# EAGLE schematic InhalerCapDevelopmentBoard (EAGLE 7.2.0)
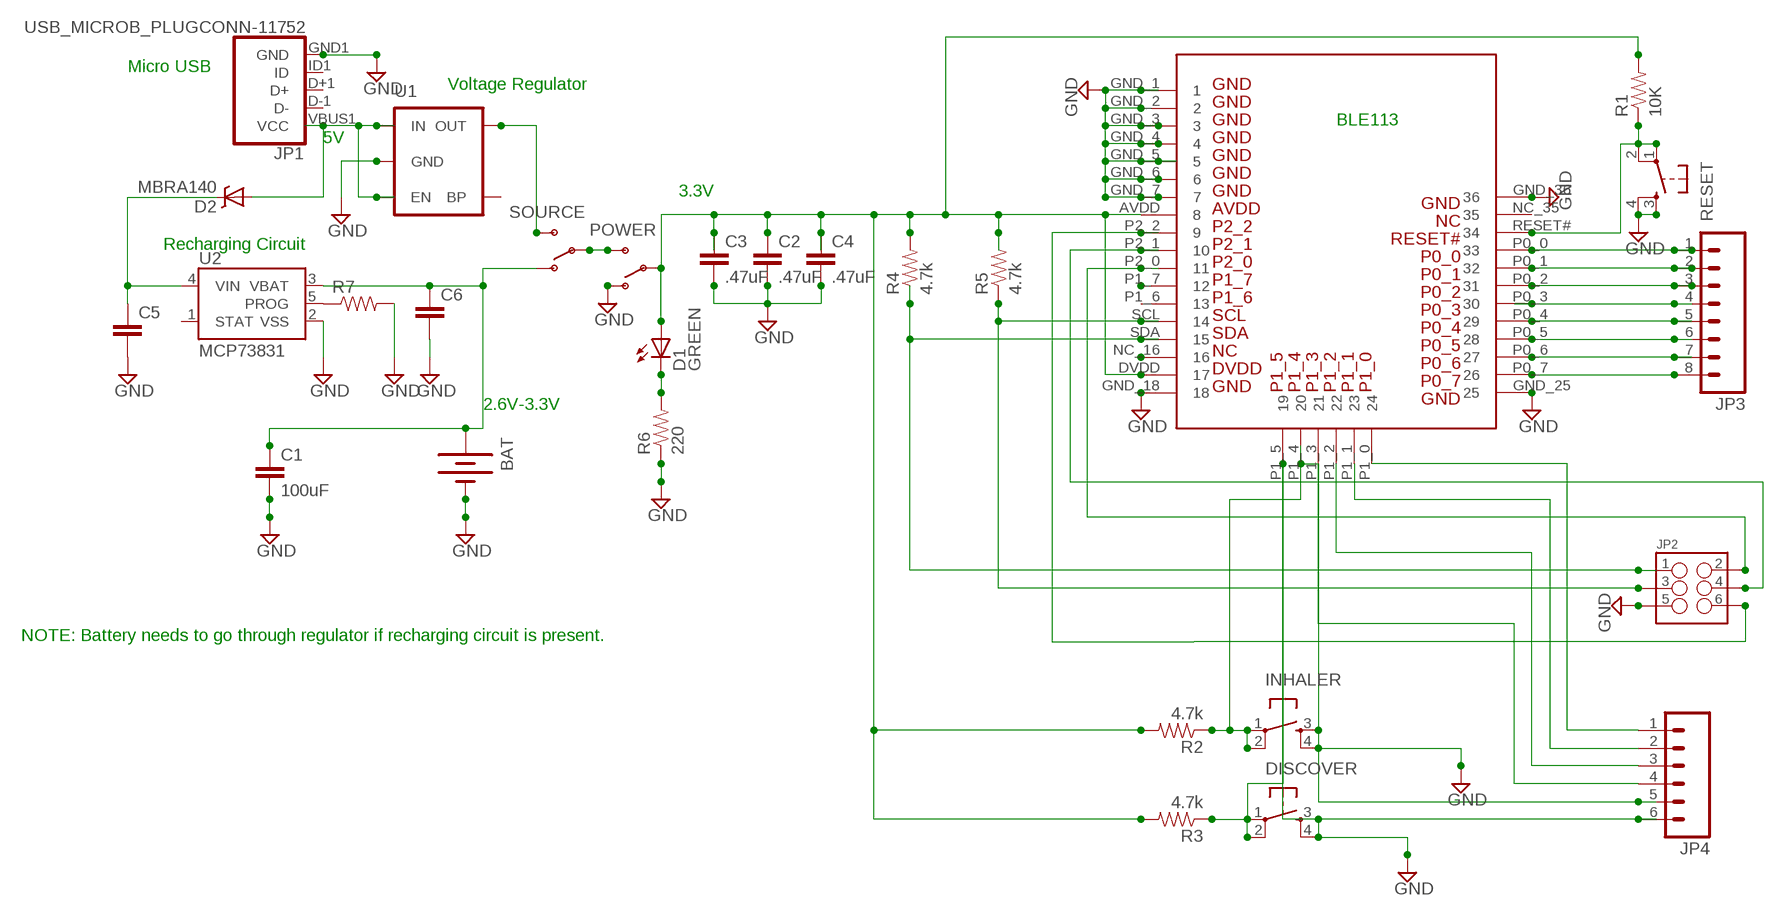
[diagram p0: schematic, sheet 1]

## Parts
BAT  BATTERY20SMD  [BATTCON_20MM]
BLE113  BLE113-A  [BLE113-A]
C1  100uF  CAP0603-CAP  [0603-CAP]
C2  .47uF  CAP0603-CAP  [0603-CAP]
C3  .47uF  CAP0603-CAP  [0603-CAP]
C4  .47uF  CAP0603-CAP  [0603-CAP]
C5  CAP0603-CAP  [0603-CAP]
C6  CAP0603-CAP  [0603-CAP]
D1  GREEN  LED-GREEN0603  [LED-0603]
D2  MBRA140  [SMA-DIODE]
DISCOVER  TAC_SWITCHSMD  [TACTILE_SWITCH_SMD]
INHALER  TAC_SWITCHSMD  [TACTILE_SWITCH_SMD]
JP1  USB_MICROB_PLUGCONN-11752  [USB-B-MICRO-SMD_V03]
JP2  M03X2SHROUD  [2X3-SHROUDED]
JP3  M08  [1X08_PIN1_NO_SILK]
JP4  M06NO_SILK  [1X06_NO_SILK]
POWER  SWITCH-SPDTSMD  [AYZ0202]
R1  10K  RESISTOR0603  [0603-RES]
R2  4.7k  RESISTOR0603  [0603-RES]
R3  4.7k  RESISTOR0603  [0603-RES]
R4  4.7k  RESISTOR0603  [0603-RES]
R5  4.7k  RESISTOR0603  [0603-RES]
R6  220  RESISTOR0603-RES  [0603-RES]
R7  RESISTOR0603-RES  [0603-RES]
RESET  TAC_SWITCHSMD  [TACTILE_SWITCH_SMD]
SOURCE  SWITCH-SPDTSMD  [AYZ0202]
U1  MIC52053.3V  [SOT23-5]
U2  MCP73831  [SOT23-5]

## Nets
GND: BAT.2(-) BLE113.GND_1 BLE113.GND_2 BLE113.GND_3 BLE113.GND_4 BLE113.GND_5 BLE113.GND_6 BLE113.GND_7 BLE113.GND_18 BLE113.GND_25 BLE113.GND_36 C1.2 C2.2 C3.2 C4.2 C5.2 C6.2 DISCOVER.3 DISCOVER.4 INHALER.3 INHALER.4 JP1.GND1(GND) JP2.5 POWER.1(O) R6.1 R7.2 RESET.3 RESET.4 U1.2(GND) U2.2(VSS)
N$1: BLE113.P1_4 INHALER.1 INHALER.2 JP4.5 R2.1
N$2: BLE113.AVDD BLE113.DVDD C2.1 C3.1 C4.1 D1.A POWER.2(P) R1.2 R2.2 R3.2 R4.2 R5.2
N$3: POWER.3(S) SOURCE.2(P)
N$5: SOURCE.3(S) U1.5(OUT)
N$6: D2.A JP1.VBUS1(VCC) U1.1(IN) U1.3(EN)
N$7: BLE113.RESET# R1.1 RESET.1 RESET.2
N$8: BLE113.P0_6 JP3.7
N$9: BLE113.P0_4 JP3.5
N$10: BLE113.P1_7
N$11: BLE113.NC_16
N$12: BLE113.P1_2 JP4.3
N$13: BLE113.P1_5 DISCOVER.1 DISCOVER.2 JP4.6 R3.1
N$14: BLE113.SDA JP2.1 R4.1
N$15: BLE113.SCL JP2.3 R5.1
N$16: D1.C R6.2
N$17: BLE113.P1_0 JP4.1
N$18: BLE113.P0_0 JP3.1
N$19: BLE113.P1_1 JP4.2
N$20: BLE113.P0_1 JP3.2
N$21: BLE113.P2_0 JP2.2
N$22: BLE113.P2_1 JP2.4
N$23: BLE113.P2_2 JP2.6
N$24: BLE113.P0_2 JP3.3
N$25: BLE113.P1_3 JP4.4
N$26: BLE113.P0_3 JP3.4
N$27: BLE113.P0_5 JP3.6
N$28: BLE113.P0_7 JP3.8
N$29: R7.1 U2.5(PROG)
N$30: C5.1 D2.C U2.4(VIN)
N$31: BAT.1(+) C1.1 C6.1 SOURCE.1(O) U2.3(VBAT)
Unconnected: BLE113.NC_35 BLE113.P1_6 JP1.D+1(D+) JP1.D-1(D-) JP1.ID1(ID) U1.4(BP) U2.1(STAT)

## Notes on the sheet
- Micro USB
- Voltage Regulator
- BLE113
- 5V
- 3.3V
- Recharging Circuit
- 2.6V-3.3V
- NOTE: Battery needs to go through regulator if recharging circuit is present.

## Library data of the parts
BAT = SparkFun-Electromechanical:BATTERY: Battery Holders Various common sizes : AA, AAA, 20mm coin cell and 12mm coin cell. 20MM_4LEGS, BATT-10373
BLE113 = BLE113-A:BLE113-A
C1 C5 = SparkFun-Passives:CAP: Capacitor Standard 0603 ceramic capacitor, and 0.1" leaded capacitor.
C2-C4 C6 = SparkFun-Capacitors:CAP: Capacitor Standard 0603 ceramic capacitor, and 0.1" leaded capacitor.
D1 = SparkFun-LED:LED-GREEN: Various green LEDs Green LEDs used in SFE Production 0603- DIO-00821 LARGE- DIO-00862 LILYPAD- DIO-09910; PROD_ID: DIO-00821
D2 = SparkFun-DiscreteSemi:MBRA140: 40V, 1A Schottky rectifier SMA/DO-214AC package DIO-08053; PROD_ID: DIO-08053
DISCOVER INHALER RESET = SparkFun-Electromechanical:TAC_SWITCH: Momentary Switch Button commonly used for reset or general input. Spark Fun Electronics SKU : COM-00097 SMT- SWCH-08247; PROD_ID: SWCH-08247
JP1 = SparkFun-Connectors:USB_MICROB_PLUG: USB Micro-B Plug Comes in a variety of packages. Check out Hirose's ZX-x0 line: http://www.hirose.co.jp/cataloge_hp/e24200011.pdf; PROD_ID: CONN-11752
JP2 = SparkFun-Connectors:M03X2: 2x3 .1" header. Shrouded, with keying- CONN-10681 SMT- CONN-11415 Pogo pins- HW-11044; PROD_ID: CONN-10681
JP3 = SparkFun-Connectors:M08: Header 8 Standard 8-pin 0.1" header. Use with straight break away headers (SKU : PRT-00116), right angle break away headers (PRT-00553), swiss pins (PRT-00743), machine pins (PRT-00117), and female headers (PRT-00115).
JP4 = SparkFun-Connectors:M06: Header 6 Standard 6-pin 0.1" header. Use with straight break away headers (SKU : PRT-00116), right angle break away headers (PRT-00553), swiss pins (PRT-00743), machine pins (PRT-00117), and female headers (PRT-00115). Molex polarized connector foot print use with SKU : PRT-08094 with associated crimp pins and housings. NOTES ON THE VARIANTS LOCK and LOCK_LONGPADS... This footprint was designed to help hold the alignment of a through-hole component (i.e. 6-pin header) while soldering it into place. You may notice that each hole has been shifted either up or down by 0.005 of an inch from it's more standard position (which is a perfectly straight line). This slight alteration caused the pins (the squares in the middle) to touch the edges of the holes. Because they are alternating, it causes a "brace" to hold the component in place. 0.005 has proven to be the perfect amount of "off-center" position when using our standard breakaway headers. Although looks a little odd when you look at the bare footprint, once you have a header in there, the alteration is very hard to notice. Also,if you push a header all the way into place, it is covered up entirely on the bottom side. This idea of altering the position of holes to aid alignment will be further integrated into the Sparkfun Library for other footprints. It can help hold any component with 3 or more connection pins.
POWER SOURCE = SparkFun-Electromechanical:SWITCH-SPDT: SPDT Switch Simple slide switch, Spark Fun Electronics SKU : COM-00102 DPDT SMT slide switch, AYZ0202, SWCH-08179; PROD_ID: SWCH-08179
R1-R5 = SparkFun-Resistors:RESISTOR: Resistor Basic schematic elements and footprints for 0603, 1206, and PTH resistors.
R6 R7 = SparkFun-Passives:RESISTOR: Resistor Basic schematic elements and footprints for 0603, 1206, and PTH resistors.
U1 = SparkFun-PowerIC:MIC5205: MIC5205 150mA vreg 3.3V - VREG-00822 5V - VREG-00823; PROD_ID: VREG-00822
U2 = SparkFun-PowerIC:MCP73831: Miniature single cell, fully integrated Li-Ion, Li-polymer charge management controller http://ww1.microchip.com/downloads/en/DeviceDoc/21984a.pdf IC-09995; PROD_ID: IC-09995